# EAGLE schematic SteinerVCF (EAGLE 9.6.2)
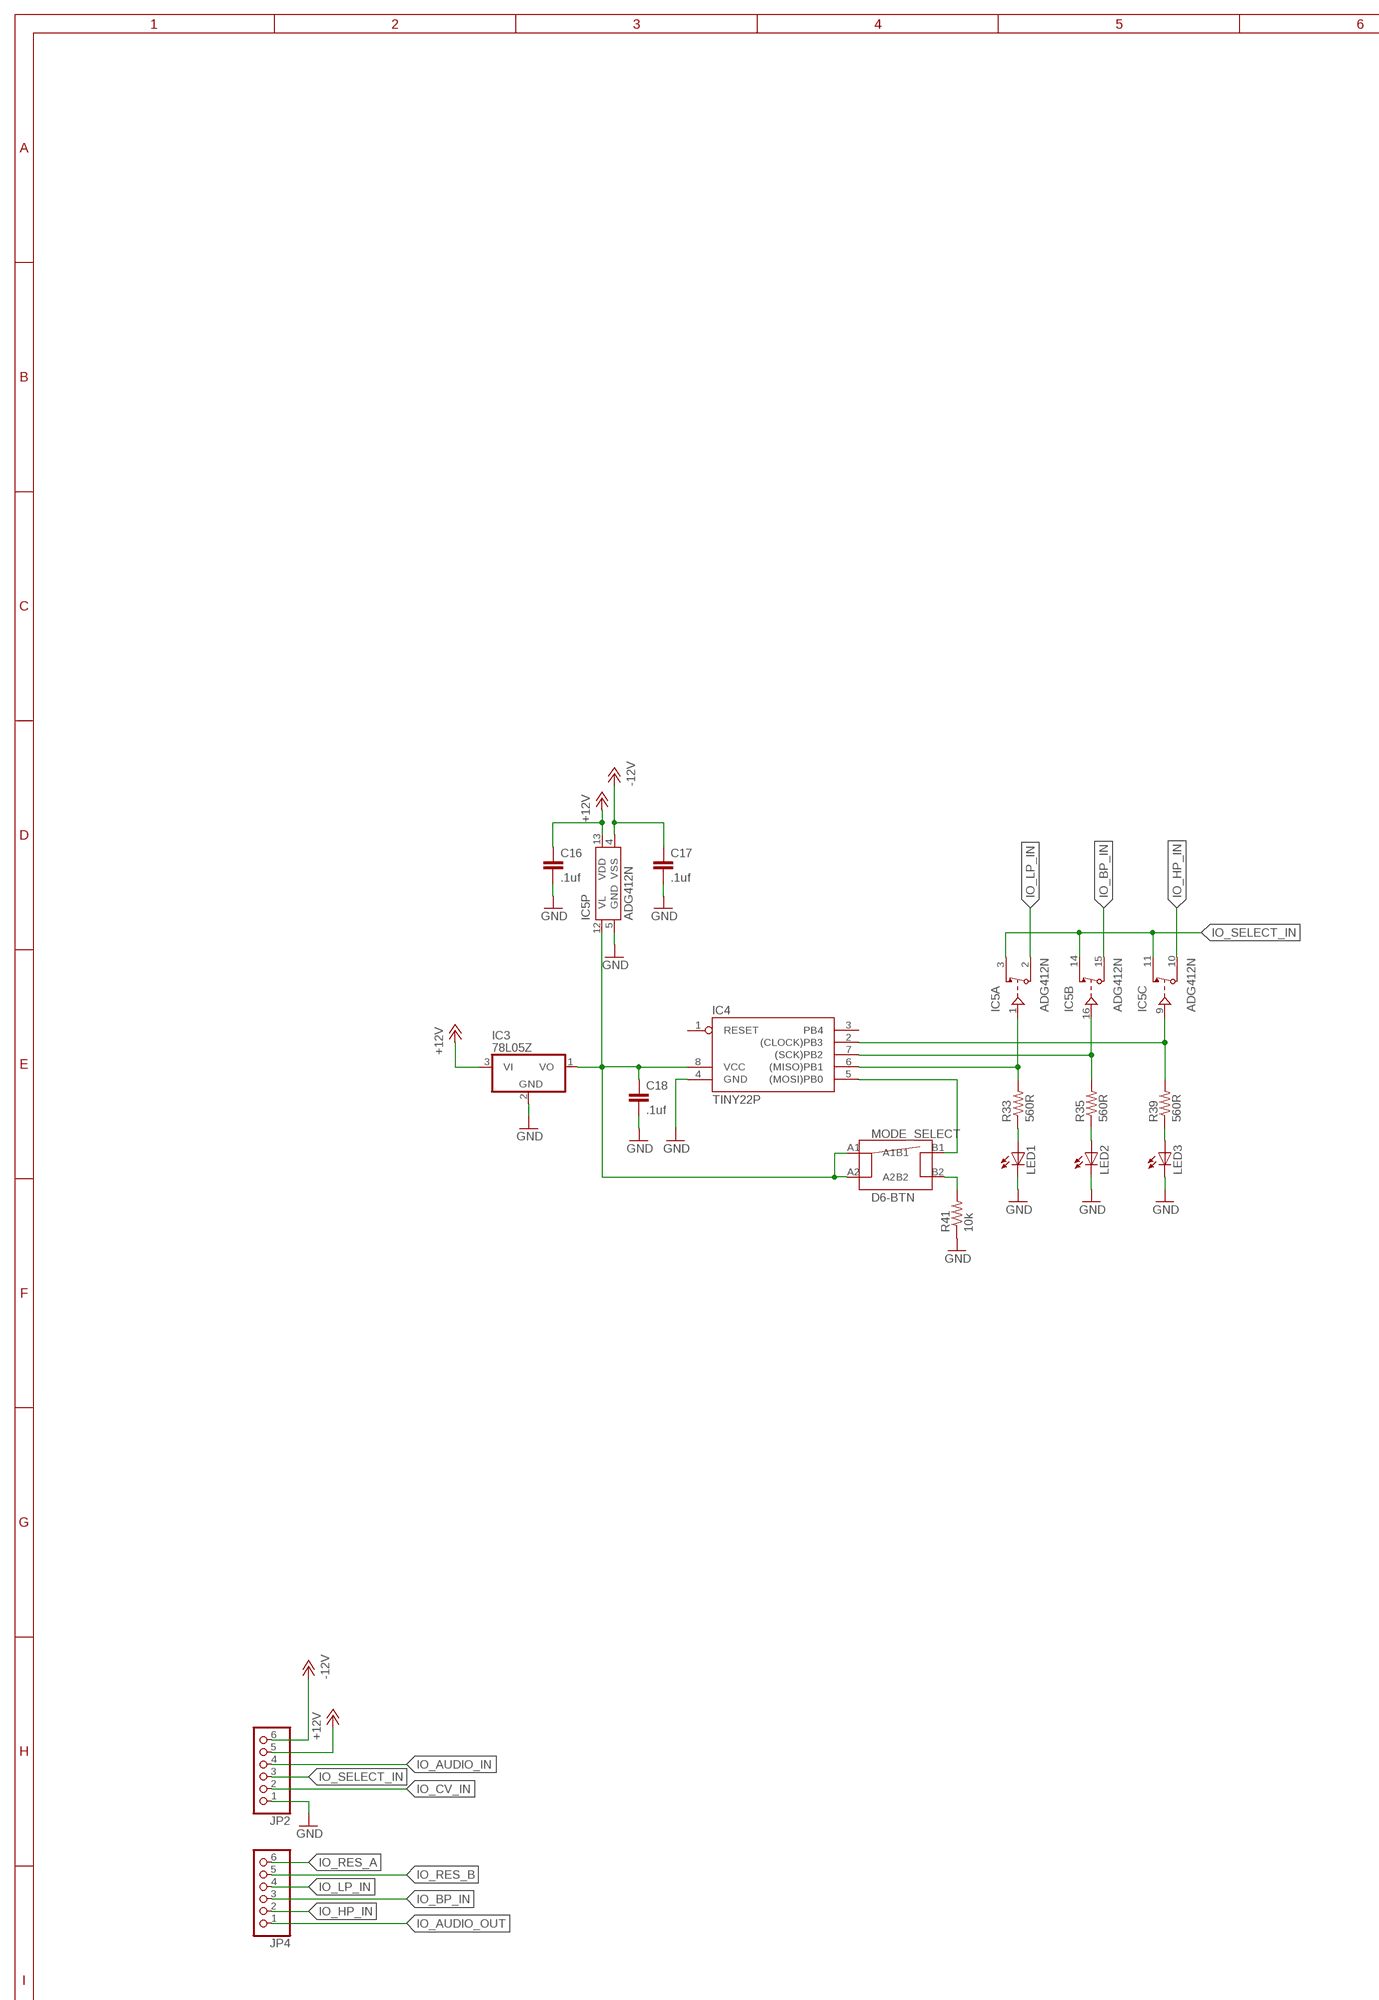
[diagram p0: schematic, sheet 1, part 1 of 2]
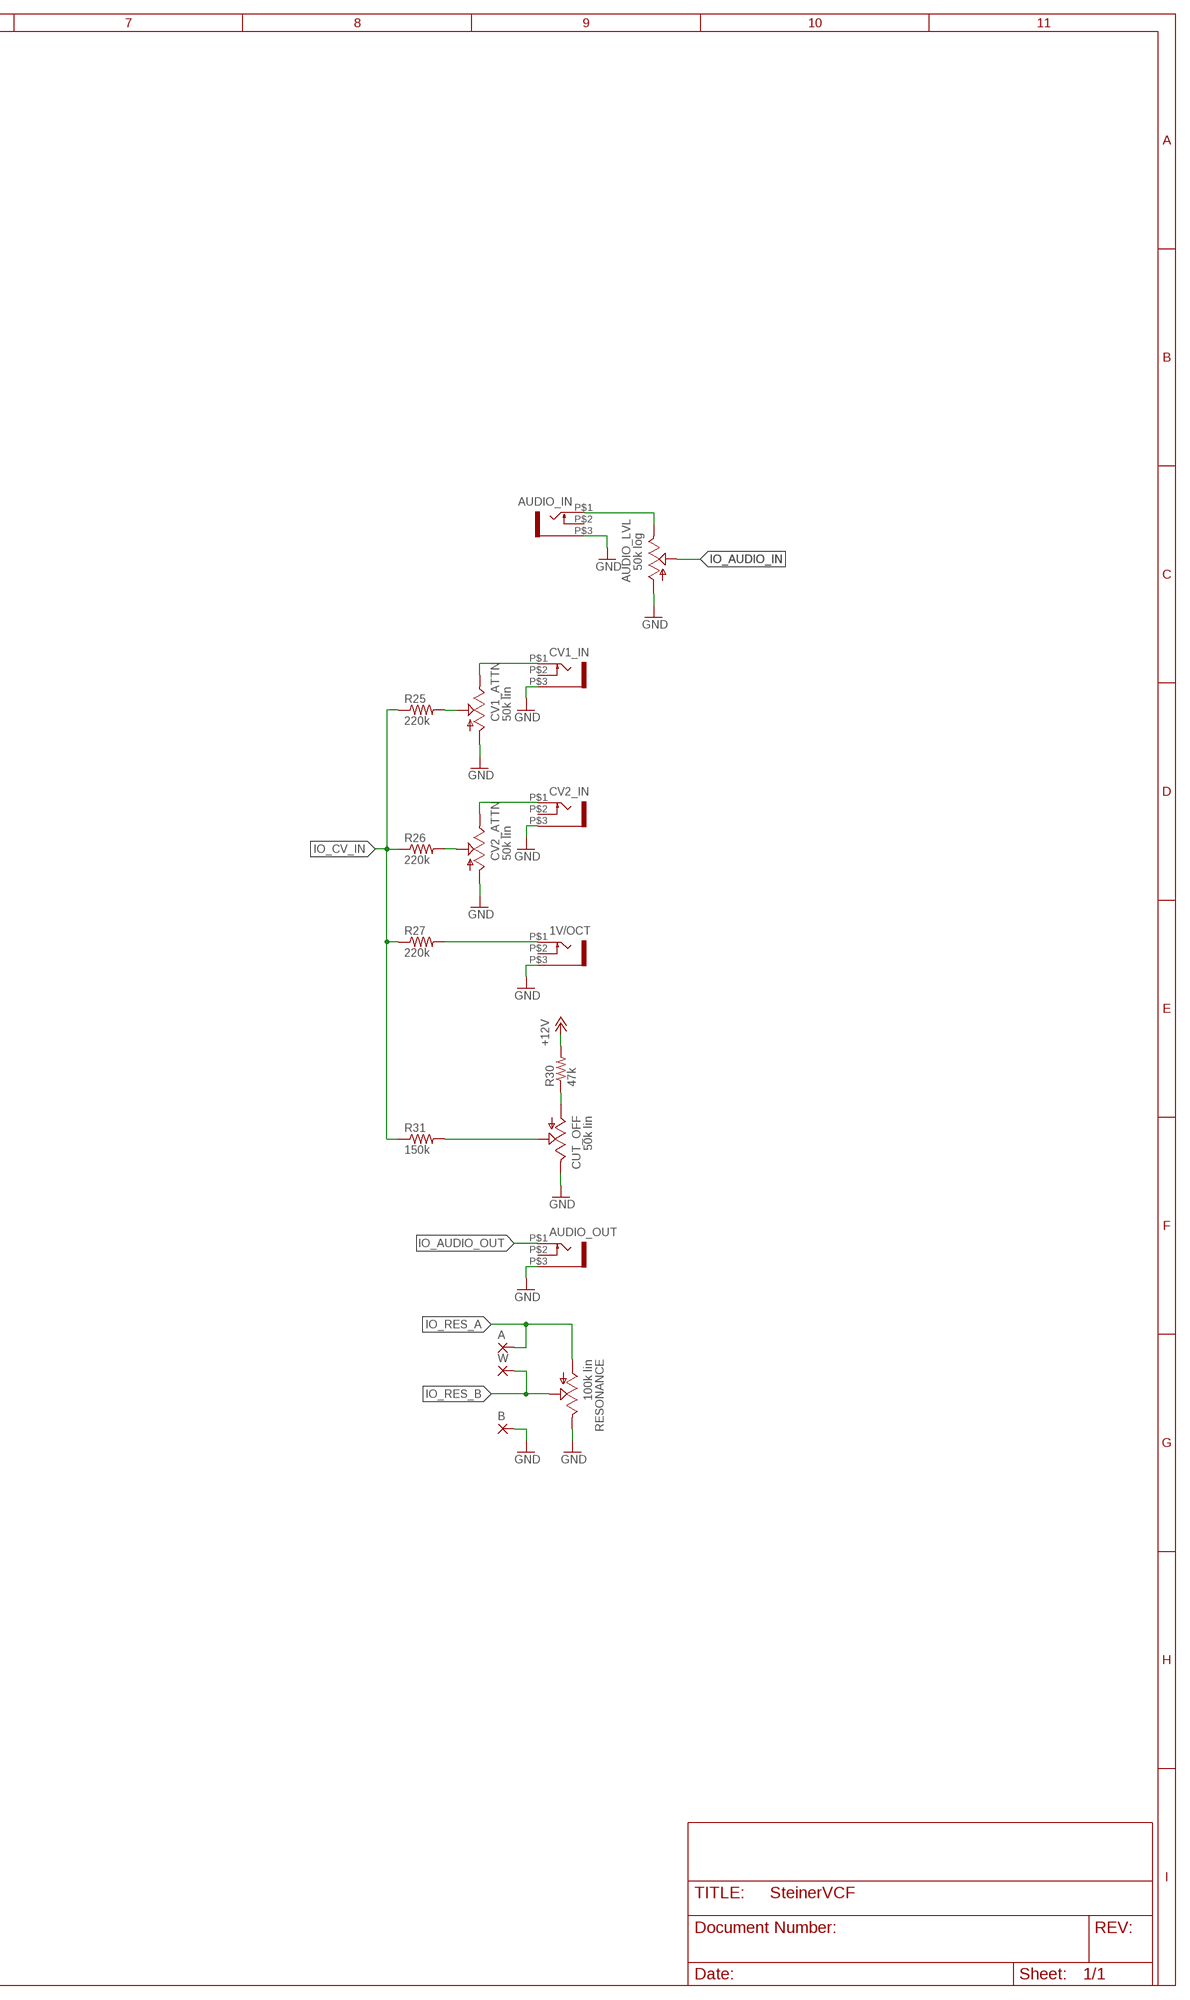
[diagram p1: schematic, sheet 1, part 2 of 2]

## Parts
1V/OCT  WQP-PJ301M-12_JACK  [WQP-PJ301M-12_JACK]
A  2,15/1,0  [2,15/1,0]
AUDIO_IN  WQP-PJ301M-12_JACK  [WQP-PJ301M-12_JACK]
AUDIO_LVL  50k log  ALPHA-9MMA  [EVUF]
AUDIO_OUT  WQP-PJ301M-12_JACK  [WQP-PJ301M-12_JACK]
B  2,15/1,0  [2,15/1,0]
C16  .1uf  C-EU050-024X044  [C050-024X044]
C17  .1uf  C-EU050-024X044  [C050-024X044]
C18  .1uf  C-EU050-024X044  [C050-024X044]
CUT_OFF  50k lin  ALPHA-9MMA  [EVUF]
CV1_ATTN  50k lin  ALPHA-9MMA  [EVUF]
CV1_IN  WQP-PJ301M-12_JACK  [WQP-PJ301M-12_JACK]
CV2_ATTN  50k lin  ALPHA-9MMA  [EVUF]
CV2_IN  WQP-PJ301M-12_JACK  [WQP-PJ301M-12_JACK]
IC3  78L05Z  [TO92]
IC4  TINY22P  [DIL08]
IC5  ADG412N  [DIL16]
JP2  PINHD-1X6  [1X06]
JP4  PINHD-1X6  [1X06]
LED1  LED3MM  [LED3MM]
LED2  LED3MM  [LED3MM]
LED3  LED3MM  [LED3MM]
MODE_SELECT  D6-BTN  [D6-BTN]
R25  220k  R-US_0204/7  [0204/7]
R26  220k  R-US_0204/7  [0204/7]
R27  220k  R-US_0204/7  [0204/7]
R30  47k  R-US_0204/7  [0204/7]
R31  150k  R-US_0204/7  [0204/7]
R33  560R  R-US_0207/7  [0207/7]
R35  560R  R-US_0207/7  [0207/7]
R39  560R  R-US_0207/7  [0207/7]
R41  10k  R-US_0207/7  [0207/7]
RESONANCE  100k lin  ALPHA-9MMA  [EVUF]
W  2,15/1,0  [2,15/1,0]

## Nets
+12V: C16.1 IC3.3(VI) IC5.13(P:VDD) JP2.5 R30.2
-12V: C17.1 IC5.4(P:VSS) JP2.6
GND: 1V/OCT.P$3 AUDIO_IN.P$3 AUDIO_LVL.1(A) AUDIO_OUT.P$3 B.1(P) C16.2 C17.2 C18.2 CUT_OFF.3(E) CV1_ATTN.1(A) CV1_IN.P$3 CV2_ATTN.1(A) CV2_IN.P$3 IC3.2(GND) IC4.4(GND) IC5.5(P:GND) JP2.1 LED1.K(C) LED2.K(C) LED3.K(C) R41.1 RESONANCE.3(E)
IO_A: IC4.6((MISO)PB1) IC5.1(A:IN) R33.2
IO_AUDIO_IN: AUDIO_LVL.2(S) JP2.4
IO_AUDIO_OUT: AUDIO_OUT.P$1 JP4.1
IO_B: IC4.7((SCK)PB2) IC5.16(B:IN) R35.2
IO_BP_IN: IC5.15(B:D) JP4.3
IO_CV_IN: JP2.2 R25.1 R26.1 R27.1 R31.1
IO_HP_IN: IC5.10(C:D) JP4.2
IO_LP_IN: IC5.2(A:D) JP4.4
IO_RES_A: A.1(P) JP4.6 RESONANCE.1(A)
IO_RES_B: JP4.5 RESONANCE.2(S) W.1(P)
IO_SELECT_IN: IC5.3(A:S) IC5.11(C:S) IC5.14(B:S) JP2.3
N$31: MODE_SELECT.B2 R41.2
N$32: C18.1 IC3.1(VO) IC4.8(VCC) IC5.12(P:VL) MODE_SELECT.A1 MODE_SELECT.A2
N$33: IC4.2((CLOCK)PB3) IC5.9(C:IN) R39.2
N$36: AUDIO_IN.P$1 AUDIO_LVL.3(E)
N$37: LED1.A R33.1
N$38: CV1_ATTN.2(S) R25.2
N$39: CV2_ATTN.2(S) R26.2
N$40: CV1_ATTN.3(E) CV1_IN.P$1
N$42: LED2.A R35.1
N$44: LED3.A R39.1
N$45: CV2_ATTN.3(E) CV2_IN.P$1
N$46: IC4.5((MOSI)PB0) MODE_SELECT.B1
N$54: CUT_OFF.1(A) R30.1
N$55: 1V/OCT.P$1 R27.2
N$56: CUT_OFF.2(S) R31.2
Unconnected: 1V/OCT.P$2 AUDIO_IN.P$2 AUDIO_OUT.P$2 CV1_IN.P$2 CV2_IN.P$2 IC4.1(RESET) IC4.3(PB4) IC5.6(D:S) IC5.7(D:D) IC5.8(D:IN)

## Library data of the parts
1V/OCT AUDIO_IN AUDIO_OUT CV1_IN CV2_IN = thonkiconn:WQP-PJ301M-12_JACK
A B W = wirepad:2,15/1,0: THROUGH-HOLE PAD
AUDIO_LVL CUT_OFF CV1_ATTN CV2_ATTN RESONANCE = TomW:ALPHA-9MM: 9 mm Square Rotary Potentiometers Source: Panasonic
C16-C18 = resistor:C-EU: CAPACITOR, European symbol
IC3 = linear:78*: Positive VOLTAGE REGULATOR Source: http://cache.national.com/ds/LM/LM78L05.pdf http://www.fairchildsemi.com/ds/LM/LM7805.pdf
IC4 = avr-7:TINY22: MICROCONTROLLER 1K ROM 128 bytes RAM 128 bytes EEPROM
IC5 = analog-devices:ADG412: LC2MOS Precision Quad SPST Switches Source: http://www.analog.com/static/imported-files/data_sheets/ADG411_412_413.pdf; MF: ALTERA CORPORATION; MPN: ADG412TQ; OC_FARNELL: 1438704; OC_NEWARK: 09B7025
JP2 JP4 = pinhead:PINHD-1X6: PIN HEADER
LED1-LED3 = led:LED: LED OSRAM: - CHIPLED LG R971, LG N971, LY N971, LG Q971, LY Q971, LO R971, LY R971 LH N974, LH R974 LS Q976, LO Q976, LY Q976 LO Q996 - Hyper CHIPLED LW Q18S LB Q993, LB Q99A, LB R99A - SideLED LS A670, LO A670, LY A670, LG A670, LP A670 LB A673, LV A673, LT A673, LW A673 LH A674 LY A675 LS A676, LA A676, LO A676, LY A676, LW A676 LS A679, LY A679, LG A679 - Hyper Micro SIDELED® LS Y876, LA Y876, LO Y876, LY Y876 LT Y87S - SmartLED LW L88C, LW L88S LB L89C, LB L89S, LG L890 LS L89K, LO L89K, LY L89K LS L896, LA L896, LO L896, LY L896 - TOPLED LS T670, LO T670, LY T670, LG T670, LP T670 LSG T670, LSP T670, LSY T670, LOP T670, LYG T670 LG T671, LOG T671, LSG T671 LB T673, LV T673, LT T673, LW T673 LH T674 LS T676, LA T676, LO T676, LY T676, LB T676, LH T676, LSB T676, LW T676 LB T67C, LV T67C, LT T67C, LS T67K, LO T67K, LY T67K, LW E67C LS E67B, LA E67B, LO E67B, LY E67B, LB E67C, LV E67C, LT E67C LW T67C LS T679, LY T679, LG T679 LS T770, LO T770, LY T770, LG T770, LP T770 LB T773, LV T773, LT T773, LW T773 LH T774 LS E675, LA E675, LY E675, LS T675 LS T776, LA T776, LO T776, LY T776, LB T776 LHGB T686 LT T68C, LB T68C - Hyper Mini TOPLED® LB M676 - Mini TOPLED Santana® LG M470 LS M47K, LO M47K, LY M47K Source: http://www.osram.convergy.de LUXEON: - LUMILED® LXK2-PW12-R00, LXK2-PW12-S00, LXK2-PW14-U00, LXK2-PW14-V00 LXK2-PM12-R00, LXK2-PM12-S00, LXK2-PM14-U00 LXK2-PE12-Q00, LXK2-PE12-R00, LXK2-PE12-S00, LXK2-PE14-T00, LXK2-PE14-U00 LXK2-PB12-K00, LXK2-PB12-L00, LXK2-PB12-M00, LXK2-PB14-N00, LXK2-PB14-P00, LXK2-PB14-Q00 LXK2-PR12-L00, LXK2-PR12-M00, LXK2-PR14-Q00, LXK2-PR14-R00 LXK2-PD12-Q00, LXK2-PD12-R00, LXK2-PD12-S00 LXK2-PH12-R00, LXK2-PH12-S00 LXK2-PL12-P00, LXK2-PL12-Q00, LXK2-PL12-R00 Source: www.luxeon.com KINGBRIGHT: KA-3528ASYC Source: www.kingbright.com
MODE_SELECT = gerbster:D6-BTN
R25-R27 R30 R31 R33 R35 R39 R41 = resistor:R-US_: RESISTOR, American symbol